# Altium schematic sheet Relay.SchDoc
size A; SheetNumber: 4; SheetTotal: 4
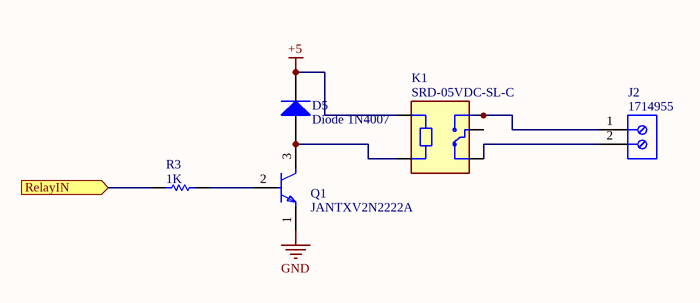
[diagram p0: Relay.SchDoc]

## Parts
D5  Diode 1N4007  [DO-41]
J2  1714955  [PHOE-1714955_V]
K1  SRD-05VDC-SL-C  [RELAY_SRD-05VDC-SL-C]
Q1  JANTXV2N2222A  [FP-TO-18-MFG]
R3  1K  [RESA60-630X240]

## Ports
RelayIN (in)

## Nets
+5: D5.2(K) K1.A1
GND: Q1.1(E)
RelayIN: R3.1 ; port RelayIN
NetD5_1: D5.1(A) K1.A2 Q1.3(C)
NetJ2_1: J2.1 K1.NO
NetJ2_2: J2.2 K1.NC
NetQ1_2: Q1.2(B) R3.2

Not connected (* = marked no-connect by the designer): K1 COM

## Library data of the parts
D5 = Diode 1N4007: 1 Amp General Purpose Rectifier; Published: 8-Jun-2000; LatestRevisionDate: 17-Jul-2002; LatestRevisionNote: Re-released for DXP Platform.; DatasheetVersion: 1998; PackageVersion: Aug-1999; PackageReference: DO-41; Publisher: Altium Limited; PackageDescription: Diode, Axial; Body 5.2 x 2.7 mm (LxDia. max), Lead Dia. 0.86 mm (max); Code_JEDEC: DO-204-AL; ComponentLink1Description: Manufacturer Link; ComponentLink1URL: http://www.fairchildsemi.com/; ComponentLink2Description: Datasheet; ComponentLink2URL: http://www.fairchildsemi.com/ds/1N%2F1N4001.pdf
J2 = CMP-2000-05797-1: PC Terminal Block, Pitch 6.35 mm, 1 x 2 Position, Height 21.5 mm, Tail Lenght 5.1 mm, RoHS, Bulk; Manufacturer: Phoenix Contact; Package Description: PC Terminal Block, Pitch 6.35 mm, 1 x 2 Position, Height 21.5 mm, Tail Lenght 5.1 mm; Datasheet URL: http://media.digikey.com/pdf/Data%20Sheets/Phoenix%20Contact%20PDFs/1714955.pdf; Package Reference: 1714955; Manufacturer URL: http://www.phoenixcontact.com/; Datasheet Version: 02/2010; Mounting Technology: ThroughHole
K1 = SRD-05VDC-SL-C: 5V Trigger Relay Module For Arduino And Raspberry Pi 5V Trigger Relay Module For Arduino And Raspberry Pi; MF: Songle Relay; Check_prices: https://www.snapeda.com/parts/SRD-05VDC-SL-C/Songle+Relay/view-part/?ref=eda; Value: *; Availability: Not in stock; Price: None; Package: NON STANDARD-5 Songle Relay; MP: SRD-05VDC-SL-C; SnapEDA_Link: https://www.snapeda.com/parts/SRD-05VDC-SL-C/Songle+Relay/view-part/?ref=snap
Q1 = CMP-00252-09163452-1: JANTXV2N2222A Small Signal Bipolar Transistor, 0.8A I(C), 50V V(BR)CEO, 1-Element, NPN, Silicon, TO-206AA; Max Power Dissipation: 500mW; Max Collector Current: 800mA; Number of Elements: 1; Collector Base Voltage (VCBO): 75V; Emitter Base Voltage (VEBO): 6V; Lifecycle Status: Production; NexarPartId: 9163452; Max Operating Temperature: 200°C; Power Dissipation: 500mW; Min Operating Temperature: -65°C; Packaging: Bulk; Collector Emitter Breakdown Voltage: 50V; Collector Emitter Voltage (VCEO): 50V; Polarity: NPN; Radiation Hardening: No; Schedule B: 8541210080; Mount: Through Hole; RoHS: Compliant; Case/Package: TO-18; Lead Free: Contains Lead; Number of Pins: 3
R3 = CMP-1659-00074-2: Axial Resistor, 10 KOhm, +/- 1%, 0.25 W, -55 to 155 degC, 2-Pin THD, RoHS, Bulk; Manufacturer: Yageo; Temperature Coefficient: 100ppm\/degreesC; Voltage Rating: 250V; Voltage Rating (DC): 200V; Resistance: 1KOhm; Max Power Dissipation: 250mW; Datasheet URL: http://www.yageo.com/documents/recent/Yageo%20LR_MFR_2013.pdf; Packaging: Bulk; RoHSCompliant: True; Mount: ThroughHole; Package Reference: MFR-25; Termination: Axial; Composition: MetalFilm; Number of Terminations: 2; Package Quantity: 200; Mounting Technology: ThroughHole; Length: 0.248inch; Max Operating Temperature: 155degC; Min Operating Temperature: -55degC; Datasheet Version: 04/2013; Lead Free: LeadFree; Manufacturer URL: http://www.yageo.com/; Tolerance: 1%; Power Rating: 250mW; Package Description: 2-Pin Axial Lead, Dia 2.4 mm, Body Length 6.3 mm; Military Standard: Not; Case\/Package: Axial